# Altium schematic sheet Main.SchDoc
size A4; SheetNumber: 1; SheetTotal: 7
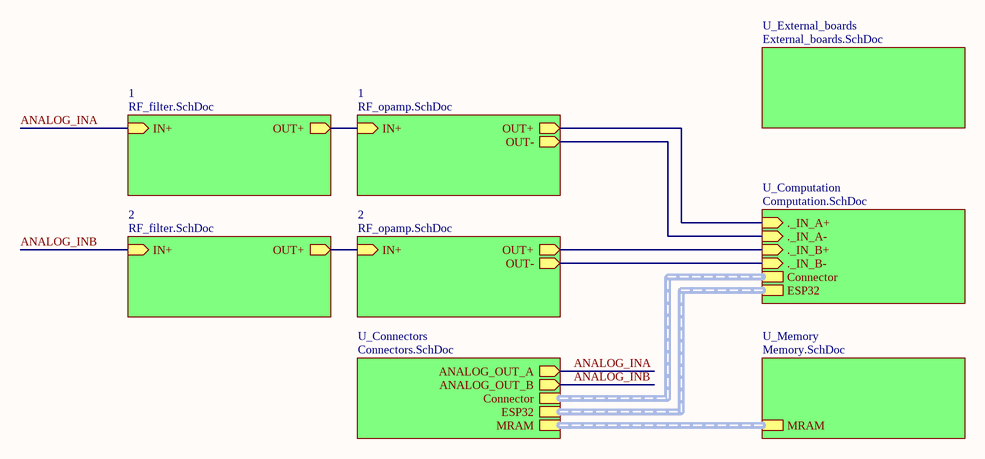
[diagram p0: Main.SchDoc]

## Sub-sheets
1 = RF_filter.SchDoc: IN+ (in), OUT+ (out)
1 = RF_opamp.SchDoc: IN+ (in), OUT+ (out), OUT- (out)
2 = RF_filter.SchDoc: IN+ (in), OUT+ (out)
2 = RF_opamp.SchDoc: IN+ (in), OUT+ (out), OUT- (out)
U_Computation = Computation.SchDoc: ._IN_B+ (in), ._IN_B- (in), ._IN_A+ (in), ._IN_A- (in), Connector (harness Connector), ESP32 (harness *)
U_Connectors = Connectors.SchDoc: ANALOG_OUT_A (out), ANALOG_OUT_B (out), Connector (harness Connector), MRAM (harness MRAM), ESP32 (harness *)
U_External_boards = External_boards.SchDoc: no entries
U_Memory = Memory.SchDoc: MRAM (harness MRAM)

## Nets
ANALOG_INA: sheet 1/IN+, sheet U_Connectors/ANALOG_OUT_A
ANALOG_INB: sheet 2/IN+, sheet U_Connectors/ANALOG_OUT_B
(unnamed): sheet 1/OUT+, sheet 1/IN+
(unnamed): sheet 1/OUT+, sheet U_Computation/._IN_A+
(unnamed): sheet 1/OUT-, sheet U_Computation/._IN_A-
(unnamed): sheet 2/OUT+, sheet 2/IN+
(unnamed): sheet 2/OUT+, sheet U_Computation/._IN_B+
(unnamed): sheet 2/OUT-, sheet U_Computation/._IN_B-

## Buses and harness runs
harness sheet U_Computation/Connector = sheet U_Connectors/Connector
harness sheet U_Computation/ESP32 = sheet U_Connectors/ESP32
harness sheet U_Connectors/MRAM = sheet U_Memory/MRAM